# Altium project RadiationDetector.PrjPcb (part 1 of 5)
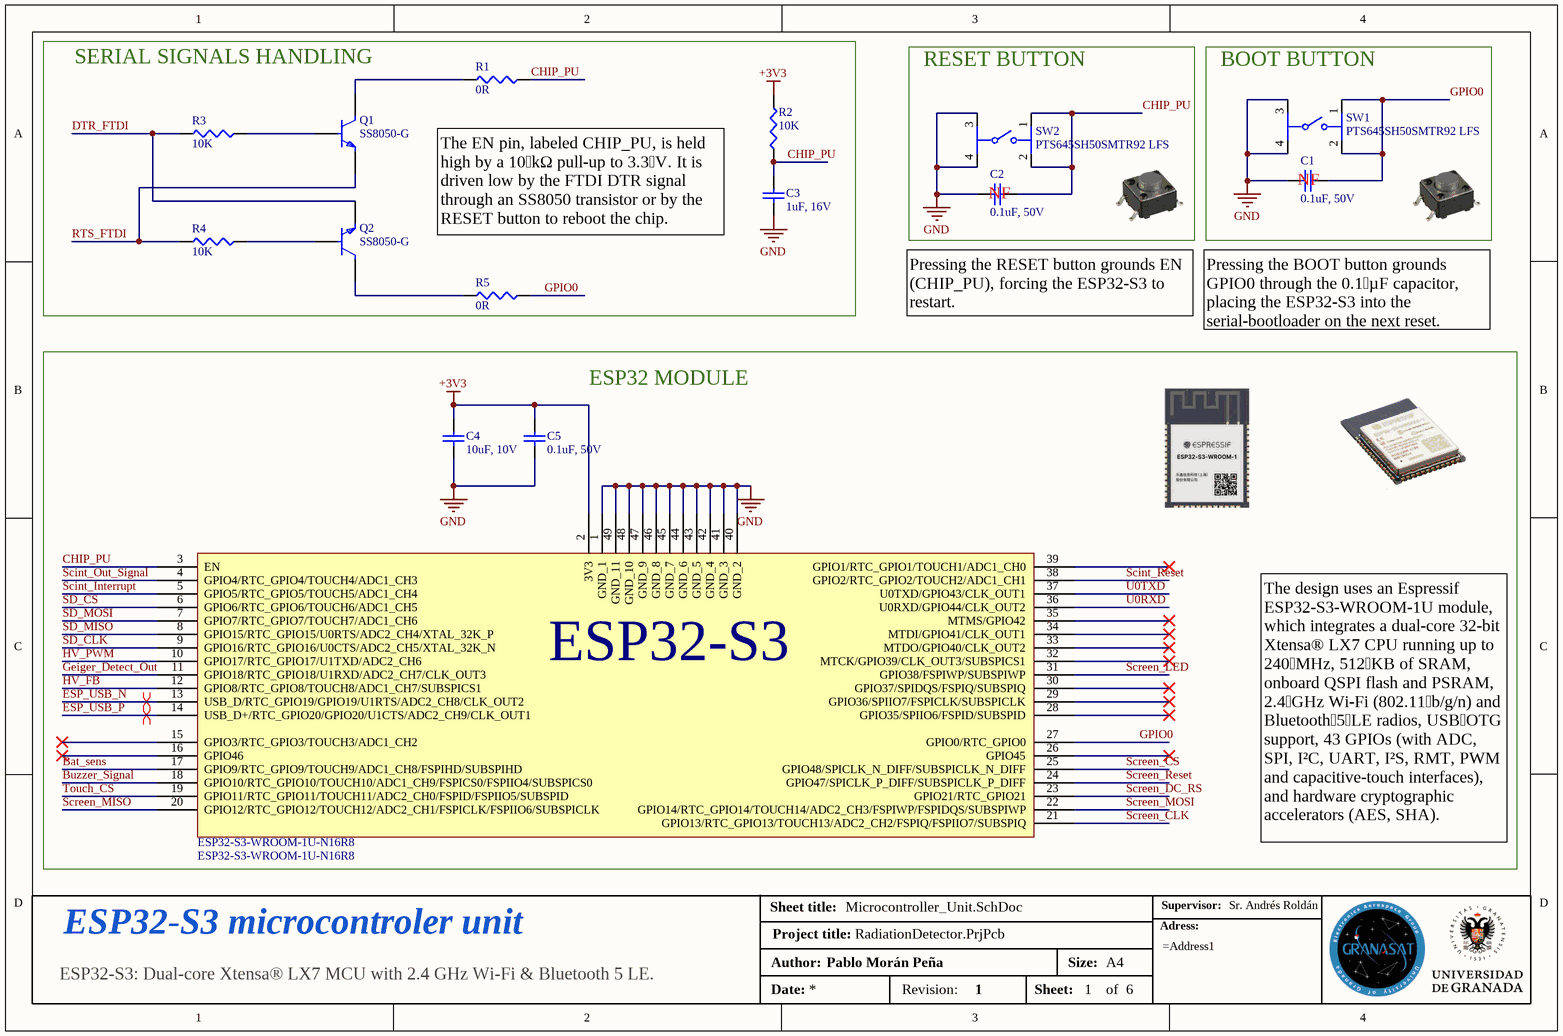
[diagram p0: Microcontroller_Unit.SchDoc]
Author: Pablo Morán Peña; Revision: 1
6 sheets, 135 parts. Net scope: global (net labels, ports and power ports of the same name join across sheets).
Board file: RadiationDetector.PcbDoc
Sheets:
  Microcontroller_Unit.SchDoc
  IO_Ports.SchDoc
  Scintillator_Circuit.SchDoc
  Peripherals.SchDoc
  Power.SchDoc
  Geiger_Circuit.SchDoc

## Sheet Microcontroller_Unit.SchDoc
size A4; CheckedBy: Sr. Andrés Roldán; Address1: Avda. Madrid 28, Edif. I+D Josefina Castro Vizoso,  2ª planta 18012 - GRANADA, SPAIN; SheetNumber: 1; SheetTotal: 6

### Parts
C1  0.1uF, 50V  [CAP 0402_1005]
C2  0.1uF, 50V  [CAP 0402_1005]
C3  1uF, 16V  [CAP 0402_1005]
C4  10uF, 10V  [CAP 0402_1005]
C5  0.1uF, 50V  [CAP 0402_1005]
ESP32-S3-WROOM-1U-N16R8  ESP32-S3-WROOM-1U-N16R8  [ESP32S3WROOM1N8R2]
Q1  SS8050-G  [FP-SS8050-G-IPC_B]
Q2  SS8050-G  [FP-SS8050-G-IPC_B]
R1  0R  [RESC1005X37N]
R2  10K  [RESC1005X37N]
R3  10K  [RESC1005X37N]
R4  10K  [RESC1005X37N]
R5  0R  [RESC1005X37N]
SW1  PTS645SH50SMTR92 LFS  [FP-PTS645SH50SMTR92LFS-MFG]
SW2  PTS645SH50SMTR92 LFS  [FP-PTS645SH50SMTR92LFS-MFG]

### Blocks framed on the sheet
SERIAL SIGNALS HANDLING: C3 Q1 Q2 R1-R5
RESET BUTTON: C2 SW2
BOOT BUTTON: C1 SW1
ESP32 MODULE: C4 C5 ESP32-S3-WROOM-1U-N16R8

### Nets
+3V3: C4.2 C5.2 ESP32-S3-WROOM-1U-N16R8.2(3V3) R2.2
GND: C1.1 C2.1 C3.1 C4.1 C5.1 ESP32-S3-WROOM-1U-N16R8.1(GND_1) ESP32-S3-WROOM-1U-N16R8.40(GND_2) ESP32-S3-WROOM-1U-N16R8.41(GND_3) ESP32-S3-WROOM-1U-N16R8.42(GND_4) ESP32-S3-WROOM-1U-N16R8.43(GND_5) ESP32-S3-WROOM-1U-N16R8.44(GND_6) ESP32-S3-WROOM-1U-N16R8.45(GND_7) ESP32-S3-WROOM-1U-N16R8.46(GND_8) ESP32-S3-WROOM-1U-N16R8.47(GND_9) ESP32-S3-WROOM-1U-N16R8.48(GND_10) ESP32-S3-WROOM-1U-N16R8.49(GND_11) SW1.3 SW1.4 SW2.3 SW2.4
Bat_sens: ESP32-S3-WROOM-1U-N16R8.17(GPIO9/RTC_GPIO9/TOUCH9/ADC1_CH8/FSPIHD/SUBSPIHD)
Buzzer_Signal: ESP32-S3-WROOM-1U-N16R8.18(GPIO10/RTC_GPIO10/TOUCH10/ADC1_CH9/FSPICS0/FSPIIO4/SUBSPICS0)
CHIP_PU: C2.2 C3.2 ESP32-S3-WROOM-1U-N16R8.3(EN) R1.2 R2.1 SW2.1 SW2.2
DTR_FTDI: Q2.2(E) R3.1
ESP_USB_N: ESP32-S3-WROOM-1U-N16R8.13(USB_D/RTC_GPIO19/GPIO19/U1RTS/ADC2_CH8/CLK_OUT2)
ESP_USB_P: ESP32-S3-WROOM-1U-N16R8.14(USB_D+/RTC_GPIO20/GPIO20/U1CTS/ADC2_CH9/CLK_OUT1)
Geiger_Detect_Out: ESP32-S3-WROOM-1U-N16R8.11(GPIO18/RTC_GPIO18/U1RXD/ADC2_CH7/CLK_OUT3)
GPIO0: C1.2 ESP32-S3-WROOM-1U-N16R8.27(GPIO0/RTC_GPIO0) R5.2 SW1.1 SW1.2
HV_FB: ESP32-S3-WROOM-1U-N16R8.12(GPIO8/RTC_GPIO8/TOUCH8/ADC1_CH7/SUBSPICS1)
HV_PWM: ESP32-S3-WROOM-1U-N16R8.10(GPIO17/RTC_GPIO17/U1TXD/ADC2_CH6)
RTS_FTDI: Q1.2(E) R4.1
Scint_Interrupt: ESP32-S3-WROOM-1U-N16R8.5(GPIO5/RTC_GPIO5/TOUCH5/ADC1_CH4)
Scint_Out_Signal: ESP32-S3-WROOM-1U-N16R8.4(GPIO4/RTC_GPIO4/TOUCH4/ADC1_CH3)
Scint_Reset: ESP32-S3-WROOM-1U-N16R8.38(GPIO2/RTC_GPIO2/TOUCH2/ADC1_CH1)
Screen_CLK: ESP32-S3-WROOM-1U-N16R8.21(GPIO13/RTC_GPIO13/TOUCH13/ADC2_CH2/FSPIQ/FSPIIO7/SUBSPIQ)
Screen_CS: ESP32-S3-WROOM-1U-N16R8.25(GPIO48/SPICLK_N_DIFF/SUBSPICLK_N_DIFF)
Screen_DC_RS: ESP32-S3-WROOM-1U-N16R8.23(GPIO21/RTC_GPIO21)
Screen_LED: ESP32-S3-WROOM-1U-N16R8.31(GPIO38/FSPIWP/SUBSPIWP)
Screen_MISO: ESP32-S3-WROOM-1U-N16R8.20(GPIO12/RTC_GPIO12/TOUCH12/ADC2_CH1/FSPICLK/FSPIIO6/SUBSPICLK)
Screen_MOSI: ESP32-S3-WROOM-1U-N16R8.22(GPIO14/RTC_GPIO14/TOUCH14/ADC2_CH3/FSPIWP/FSPIDQS/SUBSPIWP)
Screen_Reset: ESP32-S3-WROOM-1U-N16R8.24(GPIO47/SPICLK_P_DIFF/SUBSPICLK_P_DIFF)
SD_CLK: ESP32-S3-WROOM-1U-N16R8.9(GPIO16/RTC_GPIO16/U0CTS/ADC2_CH5/XTAL_32K_N)
SD_CS: ESP32-S3-WROOM-1U-N16R8.6(GPIO6/RTC_GPIO6/TOUCH6/ADC1_CH5)
SD_MISO: ESP32-S3-WROOM-1U-N16R8.8(GPIO15/RTC_GPIO15/U0RTS/ADC2_CH4/XTAL_32K_P)
SD_MOSI: ESP32-S3-WROOM-1U-N16R8.7(GPIO7/RTC_GPIO7/TOUCH7/ADC1_CH6)
Touch_CS: ESP32-S3-WROOM-1U-N16R8.19(GPIO11/RTC_GPIO11/TOUCH11/ADC2_CH0/FSPID/FSPIIO5/SUBSPID)
U0RXD: ESP32-S3-WROOM-1U-N16R8.36(U0RXD/GPIO44/CLK_OUT2)
U0TXD: ESP32-S3-WROOM-1U-N16R8.37(U0TXD/GPIO43/CLK_OUT1)
NetQ1_1: Q1.1(B) R3.2
NetQ1_3: Q1.3(C) R1.1
NetQ2_1: Q2.1(B) R4.2
NetQ2_3: Q2.3(C) R5.1

Not connected (* = marked no-connect by the designer): ESP32-S3-WROOM-1U-N16R8 15(GPIO3/RTC_GPIO3/TOUCH3/ADC1_CH2)* 16(GPIO46)* 26(GPIO45)* 28(GPIO35/SPIIO6/FSPID/SUBSPID)* 29(GPIO36/SPIIO7/FSPICLK/SUBSPICLK)* 30(GPIO37/SPIDQS/FSPIQ/SUBSPIQ)* 32(MTCK/GPIO39/CLK_OUT3/SUBSPICS1)* 33(MTDO/GPIO40/CLK_OUT2)* 34(MTDI/GPIO41/CLK_OUT1)* 35(MTMS/GPIO42)* 39(GPIO1/RTC_GPIO1/TOUCH1/ADC1_CH0)*

### Layout directives
differential pair; differential pair class DIFF90: ESP_USB_N, ESP_USB_P

### Notes on the sheet
- The EN pin, labeled CHIP_PU, is held high by a 10 kΩ pull‑up to 3.3 V. It is driven low by the FTDI DTR signal through an SS8050 transistor or by the RESET button to reboot the chip.
- (near C2) NF
- (near C1) NF
- Pressing the RESET button grounds EN (CHIP_PU), forcing the ESP32‑S3 to restart.
- Pressing the BOOT button grounds GPIO0 through the 0.1 µF capacitor, placing the ESP32‑S3 into the serial‑bootloader on the next reset.
- The design uses an Espressif ESP32‑S3‑WROOM‑1U module, which integrates a dual‑core 32‑bit Xtensa® LX7 CPU running up to 240 MHz, 512 KB of SRAM, onboard QSPI flash and PSRAM, 2.4 GHz Wi‑Fi (802.11 b/g/n) and Bluetooth 5 LE radios, USB OTG support, 43 GPIOs (with ADC, SPI, I²C, UART, I²S, RMT, PWM and capacitive‑touch interfaces), and hardware cryptographic accelerators (AES, SHA).
- Sheet title:
- Supervisor:
- ESP32-S3 microcontroler unit
- Author:
- Project title:
- Size:
- A4
- Adress:
- ESP32-S3: Dual-core Xtensa® LX7 MCU with 2.4 GHz Wi-Fi & Bluetooth 5 LE.
- Date:
- Revision:
- Sheet:
- of
- (in symbol ESP32-S3-WROOM-1-N16R8) ESP32-S3

### Library data of the parts
C1 C2 C5 = CL05B104KB5NNNC: CAP CER 0.1UF 50V X7R 0402; Manufacturer: Samsung; Dielectric Material: Ceramic; Value: 100nF; Multilayer: Yes; Tolerance  (fill in as +-): 10%; Supplier: Avnet; Supplier Part Number: CL05B104KB5NNNC; Manufacturer Part Number: CL05B104KB5NNNC; RoHS: Yes; Category: Ceramic Capacitors; Pricing: 100000=0,00598, 120000=0,00595, 220000=0,00592, 500000=0,00589, 1000000=0,00586 (USD); Mounting Technology: Surface Mount; Pins: 2; Package Shape: Rectangular; Case/Package: 0402; Terminal Finish: Nickel; Min Operating Temperature: -55°C; Max Operating Temperature: 125°C; JESD-609 Code: e3; Capacitor Type: Ceramic; Packaging: Tape and Reel; Tolerance (fill in as +-): 10%; Rated DC Voltage (URdc): 50V; Temperature Characteristics Code: X7R; Termination: Wraparound; Reach SVHC Compliant: Yes; RoHS Compliant: Yes; ComponentLink1URL: https://datasheet.ciiva.com:443/pdfs/VipMasterIC/IC/SEMS/SEMS-S-A0008523115/SEMS-S-A0008523176-1.pdf?src-supplier=IHS+Markit; ComponentLink1Description: https://datasheet.ciiva.com:443/pdfs/VipMasterIC/IC/SEMS/SEMS-S-A0008523115/SEMS-S-A0008523176-1.pdf?src-supplier=IHS+Markit; ComponentLink2URL: https://datasheet.octopart.com/CL05B104KB5NNNC-Samsung-datasheet-97040617.pdf?src-supplier=Future+Electronics; ComponentLink2Description: https://datasheet.octopart.com/CL05B104KB5NNNC-Samsung-datasheet-97040617.pdf?src-supplier=Future+Electronics; ComponentLink3URL: https://datasheet.octopart.com/CL05B104KB5NNNC-Samsung-datasheet-8326407.pdf?src-supplier=TME; ComponentLink3Description: https://datasheet.octopart.com/CL05B104KB5NNNC-Samsung-datasheet-8326407.pdf?src-supplier=TME; LCSC Part Number: C960916
C3 = CL05A105KO5NNNC: CAP CER 1UF 16V X5R 0402; Manufacturer: Samsung Electro-Mechanics; Dielectric Material: Ceramic; Multilayer: Yes; Tolerance  (fill in as +-): 10%; Supplier: Digikey; Supplier Part Number: 1276-1067-1-ND; Manufacturer Part Number: CL05A105KO5NNNC; Category: Ceramic Capacitors; Stock: 655135; Pricing: 1=0,08, 10=0,014, 100=0,0104, 1000=0,0072, 2500=0,0064 (USD); Mounting Technology: Surface Mount; Pins: 2; Package Shape: Rectangular; Case/Package: 0402; Terminal Finish: Nickel; Min Operating Temperature: -55°C; Max Operating Temperature: 85°C; JESD-609 Code: e3; Value: 1uF; Capacitor Type: Ceramic; Package Style: SMTMeter; Packaging: Tape and Reel; Tolerance (fill in as +-): 10%; Rated DC Voltage (URdc): 16V; Temperature Characteristics Code: X5R; Termination: Wraparound; Length: 1mm; Width: 0.5mm; Height: 0.55mm; Reach SVHC Compliant: Yes; RoHS Compliant: Yes; ComponentLink1URL: https://datasheet.ciiva.com:443/pdfs/VipMasterIC/IC/SEMS/SEMS-S-A0008384515/SEMS-S-A0008892675-1.pdf?src-supplier=IHS+Markit; ComponentLink1Description: https://datasheet.ciiva.com:443/pdfs/VipMasterIC/IC/SEMS/SEMS-S-A0008384515/SEMS-S-A0008892675-1.pdf?src-supplier=IHS+Markit; ComponentLink2URL: https://datasheet.octopart.com/CL05A105KO5NNNC-Samsung-Electro-Mechanics-datasheet-181960514.pdf?src-supplier=Farnell; ComponentLink2Description: https://datasheet.octopart.com/CL05A105KO5NNNC-Samsung-Electro-Mechanics-datasheet-181960514.pdf?src-supplier=Farnell; ComponentLink3URL: https://datasheet.octopart.com/CL05A105KO5NNNC-Samsung-Electro-Mechanics-datasheet-136031720.pdf?src-supplier=Samsung+SCT; ComponentLink3Description: https://datasheet.octopart.com/CL05A105KO5NNNC-Samsung-Electro-Mechanics-datasheet-136031720.pdf?src-supplier=Samsung+SCT; ComponentLink4URL: https://datasheet.octopart.com/CL05A105KO5NNNC-Samsung-Electro-Mechanics-datasheet-110226202.pdf?src-supplier=Future+Electronics; ComponentLink4Description: https://datasheet.octopart.com/CL05A105KO5NNNC-Samsung-Electro-Mechanics-datasheet-110226202.pdf?src-supplier=Future+Electronics; ComponentLink5URL: https://datasheet.octopart.com/CL05A105KO5NNNC-Samsung-Electro-Mechanics-datasheet-81461590.pdf?src-supplier=Future+Electronics; ComponentLink5Description: https://datasheet.octopart.com/CL05A105KO5NNNC-Samsung-Electro-Mechanics-datasheet-81461590.pdf?src-supplier=Future+Electronics; ComponentLink6URL: https://datasheet.octopart.com/CL05A105KO5NNNC-Samsung-Electro-Mechanics-datasheet-149136633.pdf?src-supplier=Future+Electronics; ComponentLink6Description: https://datasheet.octopart.com/CL05A105KO5NNNC-Samsung-Electro-Mechanics-datasheet-149136633.pdf?src-supplier=Future+Electronics; ComponentLink7URL: https://datasheet.octopart.com/CL05A105KO5NNNC-Samsung-Electro-Mechanics-datasheet-97040617.pdf; ComponentLink7Description: https://datasheet.octopart.com/CL05A105KO5NNNC-Samsung-Electro-Mechanics-datasheet-97040617.pdf; ComponentLink8URL: https://datasheet.octopart.com/CL05A105KO5NNNC-Samsung-Electro-Mechanics-datasheet-8324245.pdf; ComponentLink8Description: https://datasheet.octopart.com/CL05A105KO5NNNC-Samsung-Electro-Mechanics-datasheet-8324245.pdf; ComponentLink9URL: https://datasheet.octopart.com/General-Multilayer-Ceramic-Capacitors-Samsung-datasheet-family-111.pdf; ComponentLink9Description: https://datasheet.octopart.com/General-Multilayer-Ceramic-Capacitors-Samsung-datasheet-family-111.pdf; ComponentLink10URL: https://datasheet.octopart.com/CL05A105KO5NNNC-Samsung-Electro-Mechanics-datasheet-11776774.pdf?src-supplier=Arrow+Electronics; ComponentLink10Description: https://datasheet.octopart.com/CL05A105KO5NNNC-Samsung-Electro-Mechanics-datasheet-11776774.pdf?src-supplier=Arrow+Electronics; ComponentLink11URL: https://datasheet.octopart.com/CL05A105KO5NNNC-Samsung-datasheet-97040617.pdf; ComponentLink11Description: https://datasheet.octopart.com/CL05A105KO5NNNC-Samsung-datasheet-97040617.pdf; ComponentLink12URL: https://datasheet.octopart.com/CL05A105KO5NNNC-Samsung-datasheet-8324245.pdf; ComponentLink12Description: https://datasheet.octopart.com/CL05A105KO5NNNC-Samsung-datasheet-8324245.pdf; ComponentLink13URL: https://datasheet.octopart.com/CL05A105KO5NNNC-Samsung-datasheet-42280519.pdf?src-supplier=Future+Electronics; ComponentLink13Description: https://datasheet.octopart.com/CL05A105KO5NNNC-Samsung-datasheet-42280519.pdf?src-supplier=Future+Electronics; ComponentLink14URL: https://datasheet.octopart.com/CL05A105KO5NNNC-Samsung-datasheet-34152987.pdf?src-supplier=Future+Electronics; ComponentLink14Description: https://datasheet.octopart.com/CL05A105KO5NNNC-Samsung-datasheet-34152987.pdf?src-supplier=Future+Electronics; ComponentLink15URL: https://datasheet.octopart.com/CL05A105KO5NNNC-Samsung-datasheet-11776774.pdf?src-supplier=Future+Electronics; ComponentLink15Description: https://datasheet.octopart.com/CL05A105KO5NNNC-Samsung-datasheet-11776774.pdf?src-supplier=Future+Electronics; ComponentLink16URL: https://datasheet.octopart.com/CL05A105KO5NNNC-Samsung-datasheet-8329584.pdf?src-supplier=Future+Electronics; ComponentLink16Description: https://datasheet.octopart.com/CL05A105KO5NNNC-Samsung-datasheet-8329584.pdf?src-supplier=Future+Electronics; ComponentLink17URL: https://datasheet.octopart.com/CL05A105KO5NNNC-Samsung-datasheet-59220082.pdf?src-supplier=TME; ComponentLink17Description: https://datasheet.octopart.com/CL05A105KO5NNNC-Samsung-datasheet-59220082.pdf?src-supplier=TME; LCSC Part Number: C29266
C4 = CL05A106MP8NUB8: CAP CER 10UF 10V X5R 0402; Manufacturer: Samsung Electro-Mechanics; Dielectric Material: Ceramic; Multilayer: Yes; Tolerance  (fill in as +-): 20%; Supplier: Digikey; Supplier Part Number: 1276-6830-1-ND; Manufacturer Part Number: CL05A106MP8NUB8; Category: Ceramic Capacitors; Stock: 145439; Pricing: 1=0,2, 10=0,12, 100=0,0808, 1000=0,0568 (USD); Mounting Technology: Surface Mount; Pins: 2; Package Shape: Rectangular; Case/Package: 0402; Terminal Finish: Nickel; Min Operating Temperature: -55°C; Max Operating Temperature: 85°C; JESD-609 Code: e3; Value: 10uF; Capacitor Type: Ceramic; Packaging: Tape and Reel; Tolerance (fill in as +-): 20%; Rated DC Voltage (URdc): 10V; Temperature Characteristics Code: X5R; Termination: Wraparound; Reach SVHC Compliant: Yes; RoHS Compliant: Yes; ComponentLink1URL: https://datasheet.ciiva.com:443/pdfs/VipMasterIC/IC/SEMS/SEMS-S-A0008521219/SEMS-S-A0008521325-1.pdf?src-supplier=IHS+Markit; ComponentLink1Description: https://datasheet.ciiva.com:443/pdfs/VipMasterIC/IC/SEMS/SEMS-S-A0008521219/SEMS-S-A0008521325-1.pdf?src-supplier=IHS+Markit; ComponentLink2URL: https://datasheet.octopart.com/CL05A106MP8NUB8-Samsung-Electro-Mechanics-datasheet-181551178.pdf?src-supplier=Farnell; ComponentLink2Description: https://datasheet.octopart.com/CL05A106MP8NUB8-Samsung-Electro-Mechanics-datasheet-181551178.pdf?src-supplier=Farnell; ComponentLink3URL: https://datasheet.octopart.com/CL05A106MP8NUB8-Samsung-Electro-Mechanics-datasheet-141346815.pdf?src-supplier=Samsung+SCT; ComponentLink3Description: https://datasheet.octopart.com/CL05A106MP8NUB8-Samsung-Electro-Mechanics-datasheet-141346815.pdf?src-supplier=Samsung+SCT; ComponentLink4URL: https://datasheet.octopart.com/CL05A106MP8NUB8-Samsung-Electro-Mechanics-datasheet-136460857.pdf?src-supplier=Future+Electronics; ComponentLink4Description: https://datasheet.octopart.com/CL05A106MP8NUB8-Samsung-Electro-Mechanics-datasheet-136460857.pdf?src-supplier=Future+Electronics; ComponentLink5URL: https://datasheet.octopart.com/CL05A106MP8NUB8-Samsung-Electro-Mechanics-datasheet-110326781.pdf?src-supplier=Future+Electronics; ComponentLink5Description: https://datasheet.octopart.com/CL05A106MP8NUB8-Samsung-Electro-Mechanics-datasheet-110326781.pdf?src-supplier=Future+Electronics; ComponentLink6URL: https://datasheet.octopart.com/CL05A106MP8NUB8-Samsung-Electro-Mechanics-datasheet-96443587.pdf?src-supplier=Future+Electronics; ComponentLink6Description: https://datasheet.octopart.com/CL05A106MP8NUB8-Samsung-Electro-Mechanics-datasheet-96443587.pdf?src-supplier=Future+Electronics; ComponentLink7URL: https://datasheet.octopart.com/CL05A106MP8NUB8-Samsung-Electro-Mechanics-datasheet-68297032.pdf?src-supplier=Future+Electronics; ComponentLink7Description: https://datasheet.octopart.com/CL05A106MP8NUB8-Samsung-Electro-Mechanics-datasheet-68297032.pdf?src-supplier=Future+Electronics; ComponentLink8URL: https://datasheet.octopart.com/CL05A106MP8NUB8-Samsung-Electro-Mechanics-datasheet-86032222.pdf?src-supplier=Future+Electronics; ComponentLink8Description: https://datasheet.octopart.com/CL05A106MP8NUB8-Samsung-Electro-Mechanics-datasheet-86032222.pdf?src-supplier=Future+Electronics; LCSC Part Number: C307415
ESP32-S3-WROOM-1U-N16R8 = ESP32-S3-WROOM-1-N16R8: SMD Module, ESP32-S3R8 With 8 mb; Manufacturer: Espressif Systems; Supplier: Digikey; Supplier Part Number: 1965-ESP32-S3-WROOM-1U-N16R8CT-ND; Manufacturer Part Number: ESP32-S3-WROOM-1U-N16R8; RoHS: No; Category: LDO; Stock: 124; Pricing: 1=6,56, 10=5,683, 25=5,378, 100=4,9592, 250=4,7084 (USD); ComponentLink1URL: https://datasheet.octopart.com/ESP32-S3-WROOM-1U-N16R8-Espressif-Systems-datasheet-165560563.pdf?src-supplier=TME; ComponentLink1Description: https://datasheet.octopart.com/ESP32-S3-WROOM-1U-N16R8-Espressif-Systems-datasheet-165560563.pdf?src-supplier=TME; LCSC Part Number: C2913202
Q1 Q2 = SS8050-G: Transistores - Bipolar (BJT) - Simple NPN 25 V 1.5 A 100MHz 300 mW Montaje en superficie SOT-23-3; Manufacturer: Comchip; Supplier: Digikey; Supplier Part Number: 641-1790-1-ND; Manufacturer Part Number: SS8050-G; RoHS: Yes; Category: Transistors; Stock: 131317; Pricing: 1=0,24, 10=0,148, 100=0,0921, 500=0,06754, 1000=0,05958 (USD); Reach SVHC Compliant: Yes; RoHS Compliant: Yes; ComponentLink1URL: https://datasheet.ciiva.com:443/pdfs/VipMasterIC/IC/COMC/COMC-S-A0004994192/COMC-S-A0004994192-1.pdf?src-supplier=IHS+Markit; ComponentLink1Description: https://datasheet.ciiva.com:443/pdfs/VipMasterIC/IC/COMC/COMC-S-A0004994192/COMC-S-A0004994192-1.pdf?src-supplier=IHS+Markit; ComponentLink2URL: http://www.comchiptech.com/admin/files/product/SS8050-G RevA181526.pdf?src-supplier=Digikey; ComponentLink2Description: http://www.comchiptech.com/admin/files/product/SS8050-G RevA181526.pdf?src-supplier=Digikey; LCSC Part Number: C164886
R1 R5 = RC0402JR-070RL: RES 0 OHM JUMPER 1/16W 0402; Manufacturer: Yageo; Power: 62.5mW; Rated Temperature: 70°C; Package Height: 0.35mm; Package Length: 1mm; Package Width: 0.5mm; Supplier: Digikey; Supplier Part Number: 311-0.0JRCT-ND; Manufacturer Part Number: RC0402JR-070RL; RoHS: Yes; Category: Chip SMD Resistors; Stock: 1886568; Pricing: 1=0,1, 10=0,01, 25=0,0064, 50=0,0054, 100=0,0047, 250=0,00392, 500=0,00346, 1000=0,00304, 5000=0,0023 (USD); Mounting Technology: Surface Mount; Pins: 2; Package Shape: Rectangular; Case/Package: 0402; Terminal Finish: Nickel; Min Operating Temperature: -55°C; Max Operating Temperature: 155°C; JESD-609 Code: e3; Resistor Type: FIXED RESISTOR; Packaging: Tape and Reel; Value: 0R; Technology: METAL GLAZE/THICK FILM; Termination: Wraparound; Construction: Chip; Reach SVHC Compliant: Yes; RoHS Compliant: Yes; ComponentLink1URL: https://datasheet.ciiva.com:443/pdfs/VipMasterIC/IC/YAGO/YAGO-S-A0008145938/YAGO-S-A0008145938-1.pdf?src-supplier=IHS+Markit; ComponentLink1Description: https://datasheet.ciiva.com:443/pdfs/VipMasterIC/IC/YAGO/YAGO-S-A0008145938/YAGO-S-A0008145938-1.pdf?src-supplier=IHS+Markit; LCSC Part Number: C60485
R2-R4 = AC0402FR-0710KL: RES SMD 10K OHM 1% 1/16W 0402; Manufacturer: Yageo; Additional Feature: LASER TRIMMABLE; Power: 62.5mW; Rated Temperature: 70°C; Value: 10kR; Working Voltage: 50V; Temperature Coefficient (ppm/Cel): 100; Package Height: 0.32mm; Package Length: 1mm; Package Width: 0.5mm; Reference Standard: AEC-Q200; Supplier: Digikey; Supplier Part Number: YAG3436CT-ND; Manufacturer Part Number: AC0402FR-0710KL; RoHS: Yes; Category: Chip SMD Resistors; Stock: 269638; Pricing: 1=0,1, 10=0,009, 100=0,0082, 1000=0,00612, 2500=0,0051, 5000=0,00407 (USD); Mounting Technology: Surface Mount; Pins: 2; Package Shape: Rectangular; Case/Package: 0402; Terminal Finish: Nickel; Min Operating Temperature: -55°C; Max Operating Temperature: 155°C; Tolerance: 1%; JESD-609 Code: e3; Resistor Type: FIXED RESISTOR; Construction: Chip; Packaging: Tape and Reel; Technology: METAL GLAZE/THICK FILM; Termination: Wraparound; Reach SVHC Compliant: Yes; RoHS Compliant: Yes; ComponentLink1URL: https://datasheet.ciiva.com:443/pdfs/VipMasterIC/IC/YAGO/YAGO-S-A0003597364/YAGO-S-A0003597364-1.pdf?src-supplier=IHS+Markit; ComponentLink1Description: https://datasheet.ciiva.com:443/pdfs/VipMasterIC/IC/YAGO/YAGO-S-A0003597364/YAGO-S-A0003597364-1.pdf?src-supplier=IHS+Markit; ComponentLink2URL: https://datasheet.ciiva.com/12656/pyu-ac-51-rohs-l-2-12656634.pdf?src-supplier=Mouser; ComponentLink2Description: https://datasheet.ciiva.com/12656/pyu-ac-51-rohs-l-2-12656634.pdf?src-supplier=Mouser; LCSC Part Number: C144807
SW1 SW2 = PTS645SH50SMTR92LFS: SWITCH TACTILE SPST-NO 0.05A 12V; Manufacturer: ITT C&K; Manufacturer Series: PTS645; Contact Current(DC)-Max: 50mA; Contact DC Max Rating R Load: 0.05A@12VDC; Switch Action: MOMENTARY; Switch Function: SPST; Switch Type: Keypad; Actuator Type: Pushbutton; Contact Resistance: 0.1mR; Dielectric Withstand Volts: 250VACV; Insulation Resistance: 100GR; PCB Hole Count: 4; Body Breadth: 5.9944mm; Body Height: 3.4544mm; Supplier: Digikey; Supplier Part Number: CKN9085CT-ND; Manufacturer Part Number: PTS645SH50SMTR92LFS; RoHS: Yes; Category: Tactile Switches; Stock: 14865; Pricing: 1=0,33, 10=0,285, 25=0,2692, 100=0,2476, 250=0,23404, 500=0,22418 (USD); Mounting Technology: Surface Mount; Terminal Finish: Silver; Min Operating Temperature: -20°C; Max Operating Temperature: 60°C; JESD-609 Code: e4; Contact Voltage(DC)-Max: 12V; Termination: Solder; Body Length or Diameter: 5.9944mm; Terminal Length: 0.138inch; Reach SVHC Compliant: Yes; RoHS Compliant: Yes; ComponentLink1URL: https://datasheet.ciiva.com:443/pdfs/VipMasterIC/IC/CKCI/CKCI-S-A0001796527/CKCI-S-A0001796842-1.pdf?src-supplier=IHS+Markit; ComponentLink1Description: https://datasheet.ciiva.com:443/pdfs/VipMasterIC/IC/CKCI/CKCI-S-A0001796527/CKCI-S-A0001796842-1.pdf?src-supplier=IHS+Markit; ComponentLink2URL: https://datasheet.ciiva.com/29903/getdatasheetpartid-773702-29903807.pdf?src-supplier=Verical; ComponentLink2Description: https://datasheet.ciiva.com/29903/getdatasheetpartid-773702-29903807.pdf?src-supplier=Verical; ComponentLink3URL: https://datasheet.ciiva.com/14920/pts645-14920741.pdf?src-supplier=Digikey; ComponentLink3Description: https://datasheet.ciiva.com/14920/pts645-14920741.pdf?src-supplier=Digikey; ComponentLink4URL: https://datasheet.ciiva.com/22637/1707731-22637356.pdf?src-supplier=Element14; ComponentLink4Description: https://datasheet.ciiva.com/22637/1707731-22637356.pdf?src-supplier=Element14; LCSC Part Number: C221869

## Sheet IO_Ports.SchDoc
size A4; CheckedBy: Sr. Andrés Roldán; Address1: Avda. Madrid 28, Edif. I+D Josefina Castro Vizoso,  2ª planta 18012 - GRANADA, SPAIN; SheetNumber: 2; SheetTotal: 6
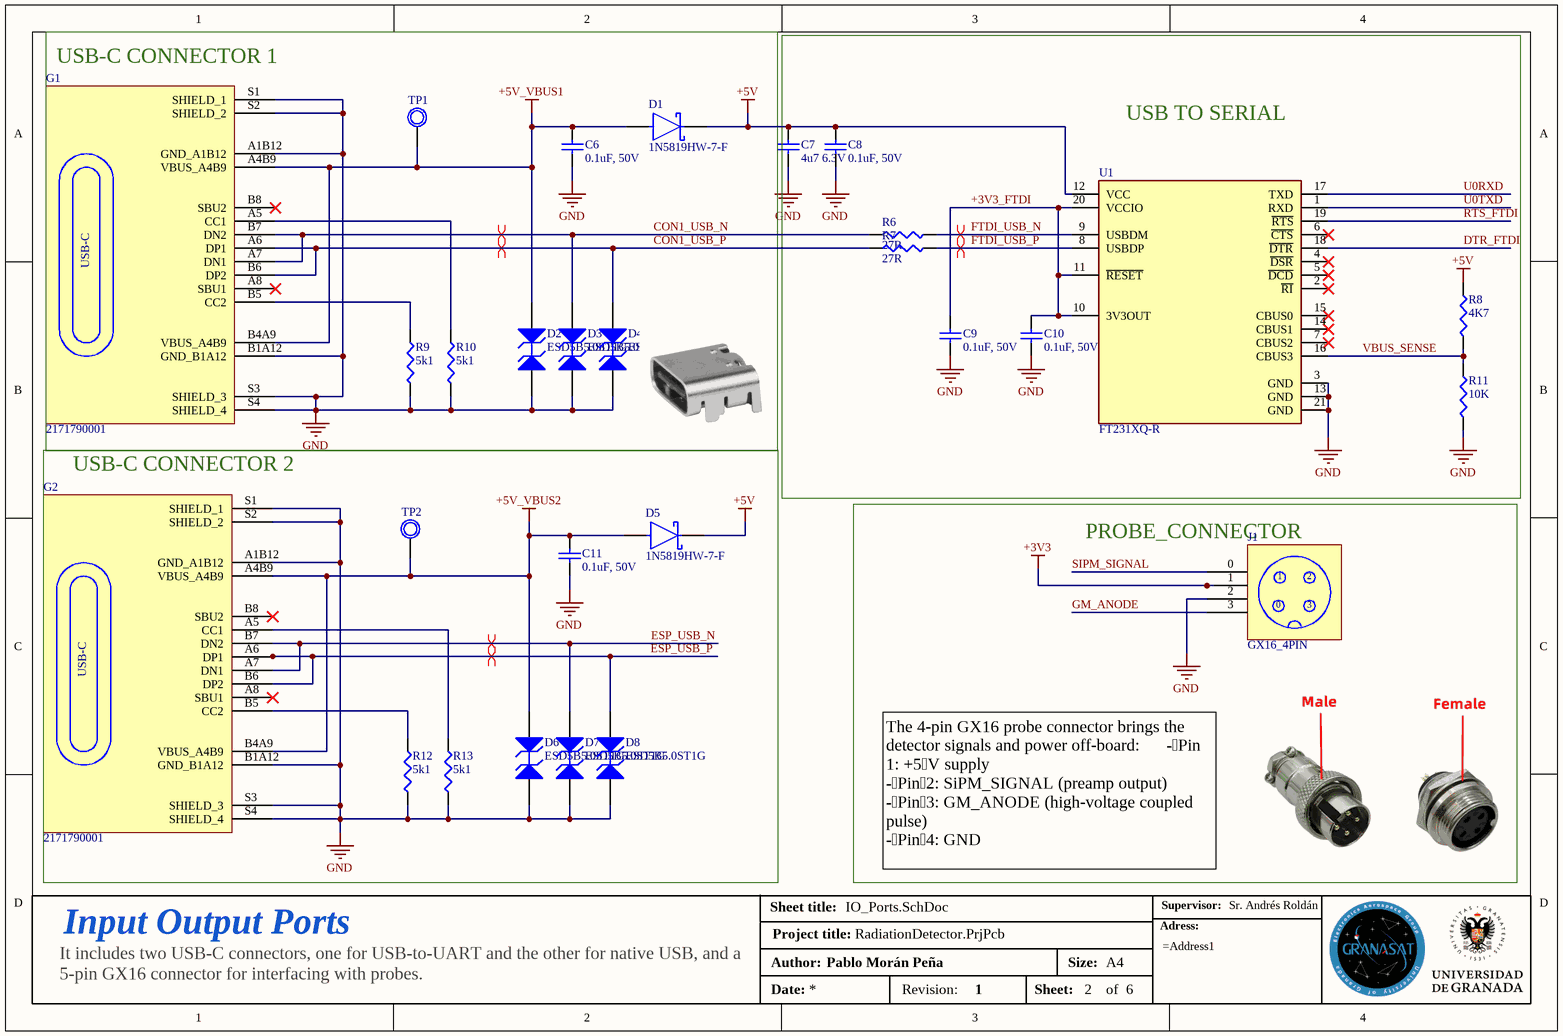
[diagram p1: IO_Ports.SchDoc]

### Parts
C6  0.1uF, 50V  [CAP 0402_1005]
C7  4u7 6.3V  [CAP 0402_1005]
C8  0.1uF, 50V  [CAP 0402_1005]
C9  0.1uF, 50V  [CAP 0402_1005]
C10  0.1uF, 50V  [CAP 0402_1005]
C11  0.1uF, 50V  [CAP 0402_1005]
D1  1N5819HW-7-F  [FP-SOD123-MFG]
D2  ESD5B5.0ST1G  [ONSC-SOD-523-2-502-01_C_V]
D3  ESD5B5.0ST1G  [ONSC-SOD-523-2-502-01_C_V]
D4  ESD5B5.0ST1G  [ONSC-SOD-523-2-502-01_C_V]
D5  1N5819HW-7-F  [FP-SOD123-MFG]
D6  ESD5B5.0ST1G  [ONSC-SOD-523-2-502-01_C_V]
D7  ESD5B5.0ST1G  [ONSC-SOD-523-2-502-01_C_V]
D8  ESD5B5.0ST1G  [ONSC-SOD-523-2-502-01_C_V]
G1  2171790001  [FP-2171790001-MFG]
G2  2171790001  [FP-2171790001-MFG]
J1  GX16_4PIN  [WIRE_HARNESS_4PIN_HV]
R6  27R  [RESC1005X37N]
R7  27R  [RESC1005X37N]
R8  4K7  [RESC1005X37N]
R9  5k1  [RESC1005X37N]
R10  5k1  [RESC1005X37N]
R11  10K  [RESC1005X37N]
R12  5k1  [RESC1005X37N]
R13  5k1  [RESC1005X37N]
TP1  Testpoint  [Testpoint]  (value not drawn)  (no BOM)
TP2  Testpoint  [Testpoint]  (value not drawn)  (no BOM)
U1  FT231XQ-R  [FP-QFN-20-MFG]

### Blocks framed on the sheet
USB-C CONNECTOR 1: C6 D1-D4 G1 R9 R10 TP1
USB TO SERIAL: C7-C10 R6-R8 R11 U1
USB-C CONNECTOR 2: C11 D5-D8 G2 R12 R13 TP2
PROBE_CONNECTOR: J1

### Nets
+3V3: J1.1
+5V: C7.2 C8.2 D1.1(C) D5.1(C) R8.2 U1.12(VCC)
+5V_VBUS1: C6.2 D1.2(A) D2.2(A2) G1.A4B9(VBUS_A4B9) G1.B4A9(VBUS_A4B9) TP1.1
+5V_VBUS2: C11.2 D5.2(A) D6.2(A2) G2.A4B9(VBUS_A4B9) G2.B4A9(VBUS_A4B9) TP2.1
GND: C6.1 C7.1 C8.1 C9.1 C10.1 C11.1 D2.1(A1) D3.1(A1) D4.1(A1) D6.1(A1) D7.1(A1) D8.1(A1) G1.A1B12(GND_A1B12) G1.B1A12(GND_B1A12) G1.S1(SHIELD_1) G1.S2(SHIELD_2) G1.S3(SHIELD_3) G1.S4(SHIELD_4) G2.A1B12(GND_A1B12) G2.B1A12(GND_B1A12) G2.S1(SHIELD_1) G2.S2(SHIELD_2) G2.S3(SHIELD_3) G2.S4(SHIELD_4) J1.2 R9.1 R10.1 R11.1 R12.1 R13.1 U1.3(GND) U1.13(GND) U1.21(GND)
+3V3_FTDI: C9.2 C10.2 U1.10(3V3OUT) U1.11(~{RESET}) U1.20(VCCIO)
CON1_USB_N: D3.2(A2) G1.A7(DN1) G1.B7(DN2) R6.1
CON1_USB_P: D4.2(A2) G1.A6(DP1) G1.B6(DP2) R7.1
DTR_FTDI: U1.18(~{DTR})
ESP_USB_N: D7.2(A2) G2.A7(DN1) G2.B7(DN2)
ESP_USB_P: D8.2(A2) G2.A6(DP1) G2.B6(DP2)
FTDI_USB_N: R6.2 U1.9(USBDM)
FTDI_USB_P: R7.2 U1.8(USBDP)
GM_ANODE: J1.3
RTS_FTDI: U1.19(~{RTS})
SIPM_SIGNAL: J1.0
U0RXD: U1.17(TXD)
U0TXD: U1.1(RXD)
VBUS_SENSE: R8.1 R11.2 U1.16(CBUS3)
NetG1_A5: G1.A5(CC1) R10.2
NetG1_B5: G1.B5(CC2) R9.2
NetG2_A5: G2.A5(CC1) R13.2
NetG2_B5: G2.B5(CC2) R12.2

Not connected (* = marked no-connect by the designer): G1 A8(SBU1)* B8(SBU2)*; G2 A8(SBU1)* B8(SBU2)*; U1 2(~{RI})* 4(~{DSR})* 5(~{DCD})* 6(~{CTS})* 7(CBUS2)* 14(CBUS1)* 15(CBUS0)*

### Layout directives
differential pair: CON1_USB_N, CON1_USB_P, ESP_USB_N, ESP_USB_P, FTDI_USB_N, FTDI_USB_P

### Notes on the sheet
- Sheet title:
- The 4‑pin GX16 probe connector brings the detector signals and power off‑board:      - Pin 1: +5 V supply
  - Pin 2: SiPM_SIGNAL (preamp output)
  - Pin 3: GM_ANODE (high‑voltage coupled pulse)
  - Pin 4: GND
- Supervisor:
- Input Output Ports
- Author:
- Project title:
- Size:
- A4
- Adress:
- It includes two USB-C connectors, one for USB-to-UART and the other for native USB, and a 5-pin GX16 connector for interfacing with probes.
- Date:
- Revision:
- Sheet:
- of
- (in symbol 217179-0001) USB-C

### Library data of the parts
C6 C8-C11 = CL05B104KB5NNNC: as C1 on sheet Microcontroller_Unit; Supplier: Avnet; Supplier Part Number: CL05B104KB5NNNC; Manufacturer Part Number: CL05B104KB5NNNC; RoHS: Yes; Category: Ceramic Capacitors; Pricing: 100000=0,00598, 120000=0,00595, 220000=0,00592, 500000=0,00589, 1000000=0,00586 (USD); Mounting Technology: Surface Mount; Pins: 2; Package Shape: Rectangular; Case/Package: 0402; Terminal Finish: Nickel; Min Operating Temperature: -55°C; Max Operating Temperature: 125°C; JESD-609 Code: e3; Capacitor Type: Ceramic; Packaging: Tape and Reel; Tolerance (fill in as +-): 10%; Rated DC Voltage (URdc): 50V; Temperature Characteristics Code: X7R; Termination: Wraparound; Reach SVHC Compliant: Yes; RoHS Compliant: Yes; ComponentLink1URL: https://datasheet.ciiva.com:443/pdfs/VipMasterIC/IC/SEMS/SEMS-S-A0008523115/SEMS-S-A0008523176-1.pdf?src-supplier=IHS+Markit; ComponentLink1Description: https://datasheet.ciiva.com:443/pdfs/VipMasterIC/IC/SEMS/SEMS-S-A0008523115/SEMS-S-A0008523176-1.pdf?src-supplier=IHS+Markit; ComponentLink2URL: https://datasheet.octopart.com/CL05B104KB5NNNC-Samsung-datasheet-97040617.pdf?src-supplier=Future+Electronics; ComponentLink2Description: https://datasheet.octopart.com/CL05B104KB5NNNC-Samsung-datasheet-97040617.pdf?src-supplier=Future+Electronics; ComponentLink3URL: https://datasheet.octopart.com/CL05B104KB5NNNC-Samsung-datasheet-8326407.pdf?src-supplier=TME; ComponentLink3Description: https://datasheet.octopart.com/CL05B104KB5NNNC-Samsung-datasheet-8326407.pdf?src-supplier=TME; LCSC Part Number: C960916
C7 = CL05A475KQ5NRNC: CAP CER 4.7UF 6.3V X5R 0402; Manufacturer: Samsung; Dielectric Material: Ceramic; Multilayer: Yes; Tolerance  (fill in as +-): 10%; Supplier: Digikey; Supplier Part Number: 1276-1481-1-ND; Manufacturer Part Number: CL05A475KQ5NRNC; RoHS: Yes; Category: Ceramic Capacitors; Stock: 1369367; Pricing: 1=0,08, 10=0,023, 100=0,016, 1000=0,0112, 2500=0,0096 (USD); Mounting Technology: Surface Mount; Pins: 2; Package Shape: Rectangular; Case/Package: 0402; Terminal Finish: Nickel; Min Operating Temperature: -55°C; Max Operating Temperature: 85°C; JESD-609 Code: e3; Value: 4.7uF; Capacitor Type: Ceramic; Packaging: Tape and Reel; Tolerance (fill in as +-): 10%; Rated DC Voltage (URdc): 6.3V; Temperature Characteristics Code: X5R; Termination: Wraparound; Reach SVHC Compliant: Yes; RoHS Compliant: Yes; ComponentLink1URL: https://datasheet.ciiva.com:443/pdfs/VipMasterIC/IC/SEMS/SEMS-S-A0008521219/SEMS-S-A0008521124-1.pdf?src-supplier=IHS+Markit; ComponentLink1Description: https://datasheet.ciiva.com:443/pdfs/VipMasterIC/IC/SEMS/SEMS-S-A0008521219/SEMS-S-A0008521124-1.pdf?src-supplier=IHS+Markit; ComponentLink2URL: https://datasheet.ciiva.com/25793/cl05a475kq5nrnc-25793634.pdf?src-supplier=Digikey; ComponentLink2Description: https://datasheet.ciiva.com/25793/cl05a475kq5nrnc-25793634.pdf?src-supplier=Digikey; LCSC Part Number: C2932473
D1 D5 = 1N5819HW-7-F: DIODE SCHOTTKY 40V 1A SOD123; Manufacturer: Diodes; Diode Element Material: SILICON; Package Body Material: Plastic; Diode Type: RECTIFIER; Number of Elements: 1; Max Power Dissipation: 450mW; Forward Voltage: 320mV; Non-rep Pk Forward Current-Max: 25A; Time @ Peak Reflow Temperature-Max (s): 40s; Qualification Status: Not Qualified; Supplier: Digikey; Supplier Part Number: 1N5819HW-FDICT-ND; Manufacturer Part Number: 1N5819HW-7-F; RoHS: Yes; Category: Schottky Diodes; Stock: 462387; Pricing: 1=0,25, 10=0,17, 100=0,1207, 500=0,10056, 1000=0,09006 (USD); Pins: 2; Package Shape: Rectangular; Terminal Finish: Tin; Min Operating Temperature: -65°C; Max Operating Temperature: 125°C; JESD-30 Code: R-PDSO-G2; Max Output current: 1A; Package Style: SMALL OUTLINEMeter; Rep Pk Reverse Voltage-Max: 40V; Surface Mount: Yes; Technology: SCHOTTKY; Terminal Form: Gull Wing; Terminal Position: DUAL; JESD-609 Code: e3; Moisture Sensitivity Level: 1; Peak Reflow Temperature (Cel): 260°C; Reach SVHC Compliant: Yes; RoHS Compliant: Yes; ComponentLink1URL: https://datasheet.ciiva.com:443/pdfs/VipMasterIC/IC/DIOD/DIOD-S-A0009689747/DIOD-S-A0009691035-1.pdf?src-supplier=IHS+Markit; ComponentLink1Description: https://datasheet.ciiva.com:443/pdfs/VipMasterIC/IC/DIOD/DIOD-S-A0009689747/DIOD-S-A0009691035-1.pdf?src-supplier=IHS+Markit; ComponentLink2URL: https://datasheet.ciiva.com/27092/1538419-27092484.pdf?src-supplier=Jameco; ComponentLink2Description: https://datasheet.ciiva.com/27092/1538419-27092484.pdf?src-supplier=Jameco; ComponentLink3URL: https://datasheet.ciiva.com/16303/ds30217-16303296.pdf?src-supplier=Future+Electronics; ComponentLink3Description: https://datasheet.ciiva.com/16303/ds30217-16303296.pdf?src-supplier=Future+Electronics; ComponentLink4URL: https://datasheet.ciiva.com/1177/ds30217-1177089.pdf?src-supplier=Element14; ComponentLink4Description: https://datasheet.ciiva.com/1177/ds30217-1177089.pdf?src-supplier=Element14; ComponentLink5URL: https://datasheet.ciiva.com/8303/ds30217-8303132.pdf?src-supplier=Avnet; ComponentLink5Description: https://datasheet.ciiva.com/8303/ds30217-8303132.pdf?src-supplier=Avnet; ComponentLink6URL: https://datasheet.ciiva.com/912/ds30217-912802.pdf?src-supplier=Digikey; ComponentLink6Description: https://datasheet.ciiva.com/912/ds30217-912802.pdf?src-supplier=Digikey; ComponentLink7URL: https://datasheet.ciiva.com/912/ds30217-912803.pdf?src-supplier=Digikey; ComponentLink7Description: https://datasheet.ciiva.com/912/ds30217-912803.pdf?src-supplier=Digikey; ComponentLink8URL: https://datasheet.ciiva.com/912/ds30217-912801.pdf?src-supplier=Digikey; ComponentLink8Description: https://datasheet.ciiva.com/912/ds30217-912801.pdf?src-supplier=Digikey; LCSC Part Number: C82544
D2-D4 D6-D8 = ESD5B5.0ST1G: TVS DIODE 5VWM SOD523; Manufacturer: ON Semiconductor; Diode Element Material: SILICON; Package Body Material: Plastic; Polarity: Bidirectional; Diode Type: TRANS VOLTAGE SUPPRESSOR; Number of Elements: 2; Max Power Dissipation: 200mW; Max Breakdown Voltage: 7.8V; Min Breakdown Voltage: 5.8V; Non-rep Peak Rev Power Dis-Max: 50W; Rep Pk Reverse Voltage-Max: 5V; Breakdown Voltage-Nom: 6.8V; Time @ Peak Reflow Temperature-Max (s): 40s; Qualification Status: Not Qualified; Supplier: Digikey; Supplier Part Number: ESD5B5.0ST1GOSCT-ND; Manufacturer Part Number: ESD5B5.0ST1G; RoHS: Yes; Category: ESD and Circuit Protection ICs; Stock: 174346; Pricing: 1=0,18, 10=0,098, 100=0,052, 500=0,051, 1000=0,05 (USD); Pins: 2; Package Shape: Rectangular; Terminal Finish: Tin; Min Operating Temperature: -55°C; Max Operating Temperature: 150°C; JESD-609 Code: e3; JESD-30 Code: R-PDSO-F2; Moisture Sensitivity Level: 1; Package Style: SMALL OUTLINEMeter; Surface Mount: Yes; Technology: AVALANCHE; Terminal Form: Flat; Terminal Position: DUAL; Peak Reflow Temperature (Cel): 260°C; Reach SVHC Compliant: Yes; RoHS Compliant: Yes; ComponentLink1URL: https://datasheet.ciiva.com:443/pdfs/VipMasterIC/IC/ONSM/ONSM-S-A0006115580/ONSM-S-A0006115580-1.pdf?src-supplier=IHS+Markit; ComponentLink1Description: https://datasheet.ciiva.com:443/pdfs/VipMasterIC/IC/ONSM/ONSM-S-A0006115580/ONSM-S-A0006115580-1.pdf?src-supplier=IHS+Markit; ComponentLink2URL: https://datasheet.ciiva.com/339/esd5b5-0st1g-339772.pdf?src-supplier=Avnet; ComponentLink2Description: https://datasheet.ciiva.com/339/esd5b5-0st1g-339772.pdf?src-supplier=Avnet; ComponentLink3URL: https://datasheet.ciiva.com/339/esd5b5-0st1g-339772.pdf?src-supplier=Digikey; ComponentLink3Description: https://datasheet.ciiva.com/339/esd5b5-0st1g-339772.pdf?src-supplier=Digikey; ComponentLink4URL: https://datasheet.ciiva.com/4510/esd5b5-0st1g-241623-4510548.pdf?src-supplier=Mouser; ComponentLink4Description: https://datasheet.ciiva.com/4510/esd5b5-0st1g-241623-4510548.pdf?src-supplier=Mouser; ComponentLink5URL: https://datasheet.ciiva.com/22637/716649-22637178.pdf?src-supplier=Element14; ComponentLink5Description: https://datasheet.ciiva.com/22637/716649-22637178.pdf?src-supplier=Element14; ComponentLink6URL: https://datasheet.ciiva.com/339/esd5b5-0st1-d-339773.pdf?src-supplier=Digikey; ComponentLink6Description: https://datasheet.ciiva.com/339/esd5b5-0st1-d-339773.pdf?src-supplier=Digikey; ComponentLink7URL: https://datasheet.ciiva.com/339/esd5b5-0st1-d-339774.pdf?src-supplier=Digikey; ComponentLink7Description: https://datasheet.ciiva.com/339/esd5b5-0st1-d-339774.pdf?src-supplier=Digikey; LCSC Part Number: C93623
G1 G2 = 217179-0001: CONN RCP USB2.0 TYP C 24P SMD RA; Manufacturer: Molex; Supplier: Digikey; Supplier Part Number: 900-2171790001CT-ND; Manufacturer Part Number: 217179-0001; RoHS: No; Category: Connectors; Stock: 19206; Pricing: 1=0,83, 10=0,704, 25=0,6596, 50=0,628, 100=0,598, 250=0,56052, 500=0,53374 (USD); LCSC Part Number: C3197684
R6 R7 = AC0402FR-0727RL: RES SMD 27 OHM 1% 1/16W 0402; Manufacturer: Yageo; Additional Feature: LASER TRIMMABLE; Power: 62.5mW; Rated Temperature: 70°C; Working Voltage: 50V; Temperature Coefficient (ppm/Cel): 100; Package Height: 0.32mm; Package Length: 1mm; Package Width: 0.5mm; Reference Standard: AEC-Q200; Supplier: Digikey; Supplier Part Number: YAG5278CT-ND; Manufacturer Part Number: AC0402FR-0727RL; RoHS: Yes; Category: Chip SMD Resistors; Stock: 4685; Pricing: 1=0,1, 10=0,01, 100=0,0071, 1000=0,00612, 2500=0,0051, 5000=0,00407 (USD); Mounting Technology: Surface Mount; Pins: 2; Package Shape: Rectangular; Case/Package: 0402; Terminal Finish: Nickel; Min Operating Temperature: -55°C; Max Operating Temperature: 155°C; Tolerance: 1%; JESD-609 Code: e3; Resistor Type: FIXED RESISTOR; Construction: Chip; Packaging: Tape and Reel; Value: 27R; Technology: METAL GLAZE/THICK FILM; Termination: Wraparound; Reach SVHC Compliant: Yes; RoHS Compliant: Yes; ComponentLink1URL: https://datasheet.ciiva.com:443/pdfs/VipMasterIC/IC/YAGO/YAGO-S-A0003597364/YAGO-S-A0003597364-1.pdf?src-supplier=IHS+Markit; ComponentLink1Description: https://datasheet.ciiva.com:443/pdfs/VipMasterIC/IC/YAGO/YAGO-S-A0003597364/YAGO-S-A0003597364-1.pdf?src-supplier=IHS+Markit; ComponentLink2URL: http://www.yageo.com/NewPortal/yageodocoutput?fileName=/pdf/R-Chip/PYu-AC_51_RoHS_L_5.pdf&src-supplier=Digikey; ComponentLink2Description: http://www.yageo.com/NewPortal/yageodocoutput?fileName=/pdf/R-Chip/PYu-AC_51_RoHS_L_5.pdf&src-supplier=Digikey; ComponentLink3URL: http://www.yageo.com/NewPortal/yageodocoutput?fileName=/pdf/R-Chip/PYu-AC_51_RoHS_L_6.pdf&src-supplier=Digikey; ComponentLink3Description: http://www.yageo.com/NewPortal/yageodocoutput?fileName=/pdf/R-Chip/PYu-AC_51_RoHS_L_6.pdf&src-supplier=Digikey; ComponentLink4URL: https://datasheet.octopart.com/AC0402FR-0727RL-Yageo-datasheet-151884373.pdf?src-supplier=Future+Electronics; ComponentLink4Description: https://datasheet.octopart.com/AC0402FR-0727RL-Yageo-datasheet-151884373.pdf?src-supplier=Future+Electronics; LCSC Part Number: C226392
R8 = AC0402FR-074K7L: RES SMD 4.7K OHM 1% 1/16W 0402; Manufacturer: Yageo; Additional Feature: LASER TRIMMABLE; Power: 62.5mW; Rated Temperature: 70°C; Value: 4.7kR; Working Voltage: 50V; Temperature Coefficient (ppm/Cel): 100; Package Height: 0.32mm; Package Length: 1mm; Package Width: 0.5mm; Reference Standard: AEC-Q200; Supplier: Digikey; Supplier Part Number: YAG3497CT-ND; Manufacturer Part Number: AC0402FR-074K7L; RoHS: Yes; Category: Chip SMD Resistors; Stock: 127046; Pricing: 1=0,1, 10=0,011, 100=0,0082, 1000=0,00612, 2500=0,0051, 5000=0,00407 (USD); Mounting Technology: Surface Mount; Pins: 2; Package Shape: Rectangular; Case/Package: 0402; Terminal Finish: Nickel; Min Operating Temperature: -55°C; Max Operating Temperature: 155°C; Tolerance: 1%; JESD-609 Code: e3; Resistor Type: FIXED RESISTOR; Construction: Chip; Packaging: Tape and Reel; Technology: METAL GLAZE/THICK FILM; Termination: Wraparound; Reach SVHC Compliant: Yes; RoHS Compliant: Yes; ComponentLink1URL: https://datasheet.ciiva.com:443/pdfs/VipMasterIC/IC/YAGO/YAGO-S-A0003597364/YAGO-S-A0003597364-1.pdf?src-supplier=IHS+Markit; ComponentLink1Description: https://datasheet.ciiva.com:443/pdfs/VipMasterIC/IC/YAGO/YAGO-S-A0003597364/YAGO-S-A0003597364-1.pdf?src-supplier=IHS+Markit; ComponentLink2URL: http://www.mouser.com/ds/2/447/yageodocoutput-1111992.pdf?src-supplier=Mouser; ComponentLink2Description: http://www.mouser.com/ds/2/447/yageodocoutput-1111992.pdf?src-supplier=Mouser; ComponentLink3URL: http://www.yageo.com/NewPortal/yageodocoutput?fileName=/pdf/R-Chip/PYu-AC_51_RoHS_L_6.pdf&src-supplier=Digikey; ComponentLink3Description: http://www.yageo.com/NewPortal/yageodocoutput?fileName=/pdf/R-Chip/PYu-AC_51_RoHS_L_6.pdf&src-supplier=Digikey; ComponentLink4URL: http://www.yageo.com/documents/recent/PYu-AC_51_RoHS_L_2_revised.pdf?src-supplier=Future+Electronics; ComponentLink4Description: http://www.yageo.com/documents/recent/PYu-AC_51_RoHS_L_2_revised.pdf?src-supplier=Future+Electronics; LCSC Part Number: C174364
R9 R10 R12 R13 = AC0402FR-075K1L: RES SMD 5.1K OHM 1% 1/16W 0402; Manufacturer: Yageo; Additional Feature: LASER TRIMMABLE; Power: 62.5mW; Rated Temperature: 70°C; Value: 5.1kR; Working Voltage: 50V; Temperature Coefficient (ppm/Cel): 100; Package Height: 0.32mm; Package Length: 1mm; Package Width: 0.5mm; Reference Standard: AEC-Q200; Supplier: Digikey; Supplier Part Number: YAG3503CT-ND; Manufacturer Part Number: AC0402FR-075K1L; RoHS: Yes; Category: Chip SMD Resistors; Stock: 58891; Pricing: 1=0,1, 10=0,009, 100=0,0071, 1000=0,00612, 2500=0,0051, 5000=0,00407, 10000=0,00204 (USD); Mounting Technology: Surface Mount; Pins: 2; Package Shape: Rectangular; Case/Package: 0402; Terminal Finish: Nickel; Min Operating Temperature: -55°C; Max Operating Temperature: 155°C; Tolerance: 1%; JESD-609 Code: e3; Resistor Type: FIXED RESISTOR; Construction: Chip; Packaging: Tape and Reel; Technology: METAL GLAZE/THICK FILM; Termination: Wraparound; Reach SVHC Compliant: Yes; RoHS Compliant: Yes; ComponentLink1URL: https://datasheet.ciiva.com:443/pdfs/VipMasterIC/IC/YAGO/YAGO-S-A0003597364/YAGO-S-A0003597364-1.pdf?src-supplier=IHS+Markit; ComponentLink1Description: https://datasheet.ciiva.com:443/pdfs/VipMasterIC/IC/YAGO/YAGO-S-A0003597364/YAGO-S-A0003597364-1.pdf?src-supplier=IHS+Markit; ComponentLink2URL: https://datasheet.octopart.com/AC0402FR-075K1L-Yageo-datasheet-166720450.pdf?src-supplier=Future+Electronics; ComponentLink2Description: https://datasheet.octopart.com/AC0402FR-075K1L-Yageo-datasheet-166720450.pdf?src-supplier=Future+Electronics; ComponentLink3URL: http://www.yageo.com/documents/recent/PYu-AC_51_RoHS_L_2_revised.pdf?src-supplier=Future+Electronics; ComponentLink3Description: http://www.yageo.com/documents/recent/PYu-AC_51_RoHS_L_2_revised.pdf?src-supplier=Future+Electronics; ComponentLink4URL: http://www.yageo.com/NewPortal/yageodocoutput?fileName=/pdf/R-Chip/PYu-AC_51_RoHS_L_6.pdf&src-supplier=Digikey; ComponentLink4Description: http://www.yageo.com/NewPortal/yageodocoutput?fileName=/pdf/R-Chip/PYu-AC_51_RoHS_L_6.pdf&src-supplier=Digikey; LCSC Part Number: C144745
R11 = AC0402FR-0710KL: as R2 on sheet Microcontroller_Unit; Supplier: Digikey; Supplier Part Number: YAG3436CT-ND; Manufacturer Part Number: AC0402FR-0710KL; RoHS: Yes; Category: Chip SMD Resistors; Stock: 269638; Pricing: 1=0,1, 10=0,009, 100=0,0082, 1000=0,00612, 2500=0,0051, 5000=0,00407 (USD); Mounting Technology: Surface Mount; Pins: 2; Package Shape: Rectangular; Case/Package: 0402; Terminal Finish: Nickel; Min Operating Temperature: -55°C; Max Operating Temperature: 155°C; Tolerance: 1%; JESD-609 Code: e3; Resistor Type: FIXED RESISTOR; Construction: Chip; Packaging: Tape and Reel; Technology: METAL GLAZE/THICK FILM; Termination: Wraparound; Reach SVHC Compliant: Yes; RoHS Compliant: Yes; ComponentLink1URL: https://datasheet.ciiva.com:443/pdfs/VipMasterIC/IC/YAGO/YAGO-S-A0003597364/YAGO-S-A0003597364-1.pdf?src-supplier=IHS+Markit; ComponentLink1Description: https://datasheet.ciiva.com:443/pdfs/VipMasterIC/IC/YAGO/YAGO-S-A0003597364/YAGO-S-A0003597364-1.pdf?src-supplier=IHS+Markit; ComponentLink2URL: https://datasheet.ciiva.com/12656/pyu-ac-51-rohs-l-2-12656634.pdf?src-supplier=Mouser; ComponentLink2Description: https://datasheet.ciiva.com/12656/pyu-ac-51-rohs-l-2-12656634.pdf?src-supplier=Mouser; LCSC Part Number: C144807
U1 = FT231XQ-R: IC USB SERIAL FULL UART 20QFN; Manufacturer: FTDI; Power Supplies: 3.3/5V; Max Supply Current: 8.4mA; Max Supply Voltage: 5.5V; Min Supply Voltage: 2.97V; Nominal Supply Voltage: 5V; Qualification Status: Not Qualified; Supplier: Digikey; Supplier Part Number: 768-1128-1-ND; Manufacturer Part Number: FT231XQ-R; RoHS: Yes; Category: Interface ICs; Stock: 35376; Pricing: 1=2,34, 25=2,27, 100=2,2, 250=2, 500=1,82002, 1000=1,7625 (USD); Case/Package: HVQCCN; Pins: 20; Package Shape: Square; Min Operating Temperature: -40°C; Max Operating Temperature: 85°C; JESD-30 Code: S-XQCC-N20; Package Style: CHIP CARRIER, HEAT SINK/SLUG, VERY THIN PROFILEMeter; Surface Mount: Yes; Technology: CMOS; Terminal Form: No Lead; Terminal Position: QUAD; Length: 4mm; Width: 4mm; Height - Seated (Max): 0.8mm; Terminal Pitch: 0.5mm; Temperature Grade: INDUSTRIAL; Reach SVHC Compliant: Yes; RoHS Compliant: Yes; ComponentLink1URL: https://datasheet.ciiva.com:443/pdfs/VipMasterIC/IC/FTDI/FTDIS00099/FTDIS00099-1.pdf?src-supplier=IHS+Markit; ComponentLink1Description: https://datasheet.ciiva.com:443/pdfs/VipMasterIC/IC/FTDI/FTDIS00099/FTDIS00099-1.pdf?src-supplier=IHS+Markit; ComponentLink2URL: https://datasheet.ciiva.com/1787/ds-ft231x-1787312.pdf?src-supplier=Digikey; ComponentLink2Description: https://datasheet.ciiva.com/1787/ds-ft231x-1787312.pdf?src-supplier=Digikey; ComponentLink3URL: https://datasheet.ciiva.com/4787/ds-ft231x-13571-4787570.pdf?src-supplier=Mouser; ComponentLink3Description: https://datasheet.ciiva.com/4787/ds-ft231x-13571-4787570.pdf?src-supplier=Mouser; ComponentLink4URL: https://datasheet.ciiva.com/30475/0900766b811020d3-30475405.pdf?src-supplier=Rs; ComponentLink4Description: https://datasheet.ciiva.com/30475/0900766b811020d3-30475405.pdf?src-supplier=Rs; ComponentLink5URL: https://datasheet.ciiva.com/1787/ft-x-series-1787313.pdf?src-supplier=Digikey; ComponentLink5Description: https://datasheet.ciiva.com/1787/ft-x-series-1787313.pdf?src-supplier=Digikey; ComponentLink6URL: https://datasheet.ciiva.com/1787/ft-x-series-1787314.pdf?src-supplier=Digikey; ComponentLink6Description: https://datasheet.ciiva.com/1787/ft-x-series-1787314.pdf?src-supplier=Digikey; LCSC Part Number: C132159